# Altium schematic sheet LEDA_Arcade Controller Touch sensor.schdoc
size 306 x 217 mm
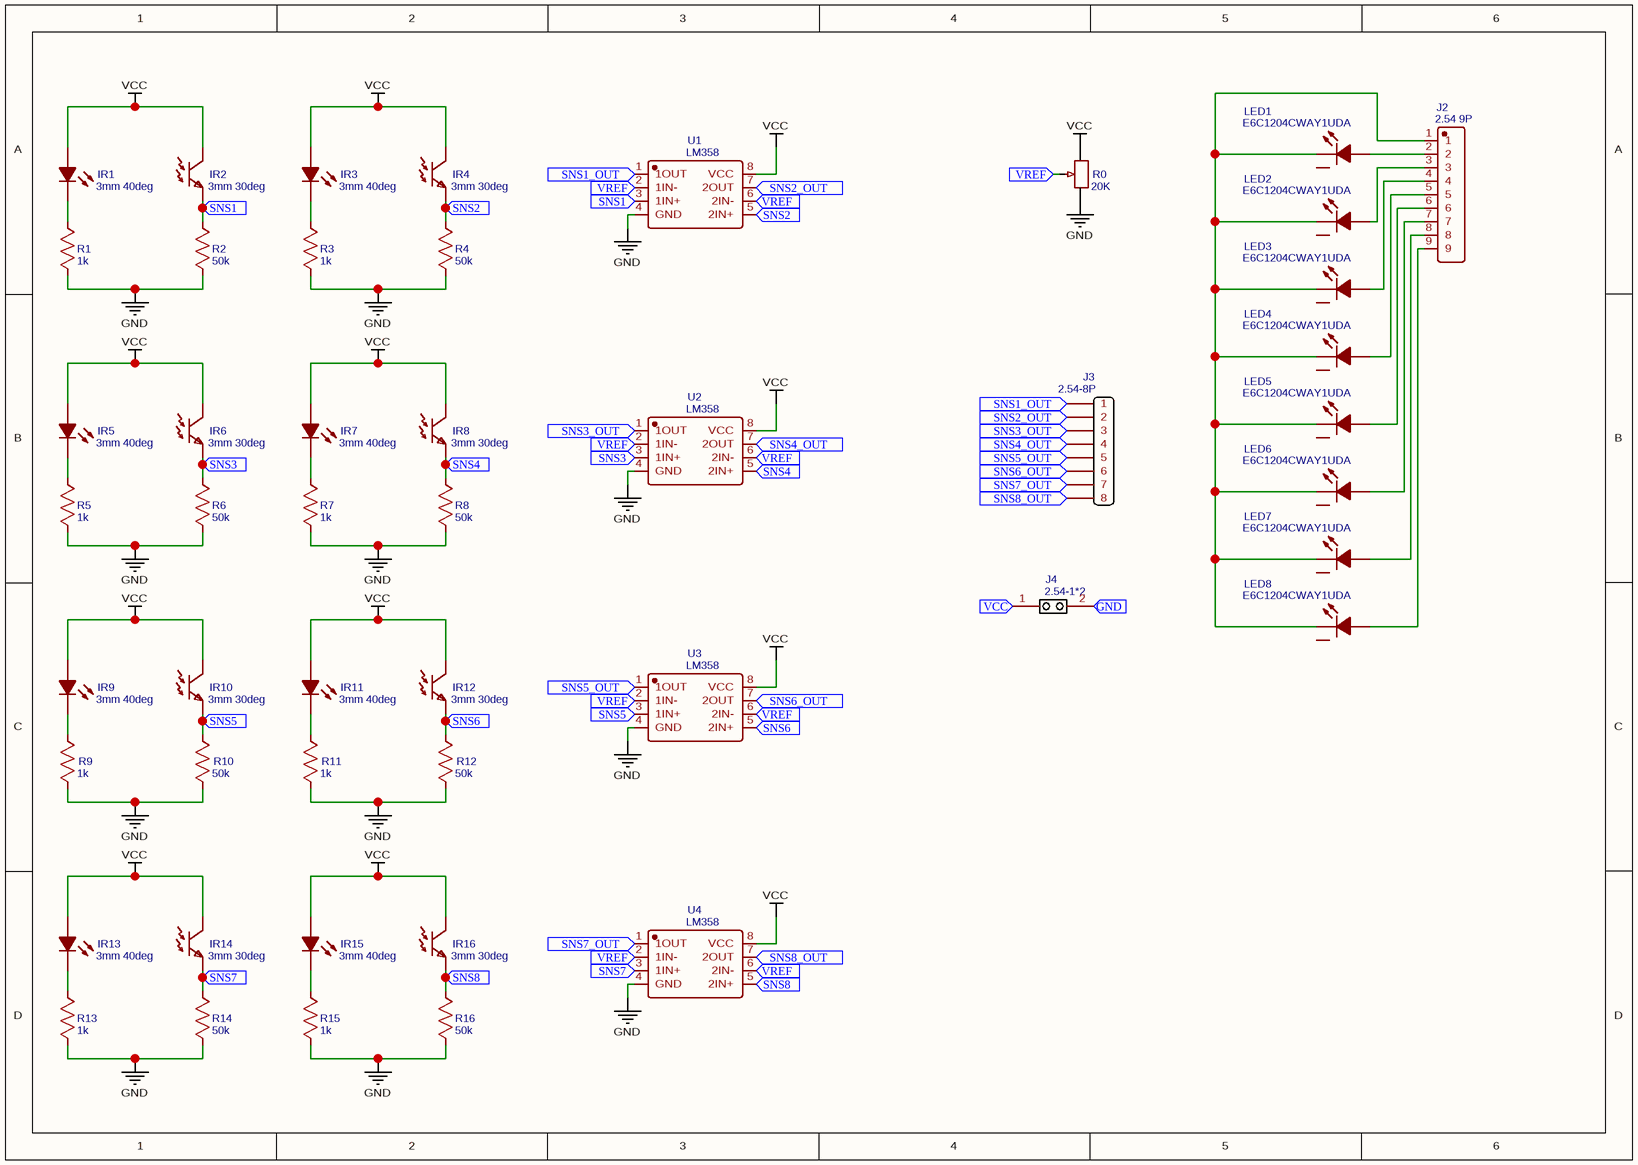
[diagram p0: LEDA_Arcade Controller Touch sensor.schdoc]

## Parts
IR1  3mm 40deg  [DIODE_IR204-A-L]
IR2  3mm 30deg  [IR-3MM/2.54]
IR3  3mm 40deg  [DIODE_IR204-A-L]
IR4  3mm 30deg  [IR-3MM/2.54]
IR5  3mm 40deg  [DIODE_IR204-A-L]
IR6  3mm 30deg  [IR-3MM/2.54]
IR7  3mm 40deg  [DIODE_IR204-A-L]
IR8  3mm 30deg  [IR-3MM/2.54]
IR9  3mm 40deg  [DIODE_IR204-A-L]
IR10  3mm 30deg  [IR-3MM/2.54]
IR11  3mm 40deg  [DIODE_IR204-A-L]
IR12  3mm 30deg  [IR-3MM/2.54]
IR13  3mm 40deg  [DIODE_IR204-A-L]
IR14  3mm 30deg  [IR-3MM/2.54]
IR15  3mm 40deg  [DIODE_IR204-A-L]
IR16  3mm 30deg  [IR-3MM/2.54]
J2  2.54 9P  [1X9_2.54MM_PTH]
J3  2.54-8P  [2.54-1*8P_TIGHT_JX]
J4  2.54-1*2  [2.54-1*2P_JX]
LED1  E6C1204CWAY1UDA  [LED-SMD_3P-L3.20-W1.50-R-RD]
LED2  E6C1204CWAY1UDA  [LED-SMD_3P-L3.20-W1.50-R-RD]
LED3  E6C1204CWAY1UDA  [LED-SMD_3P-L3.20-W1.50-R-RD]
LED4  E6C1204CWAY1UDA  [LED-SMD_3P-L3.20-W1.50-R-RD]
LED5  E6C1204CWAY1UDA  [LED-SMD_3P-L3.20-W1.50-R-RD]
LED6  E6C1204CWAY1UDA  [LED-SMD_3P-L3.20-W1.50-R-RD]
LED7  E6C1204CWAY1UDA  [LED-SMD_3P-L3.20-W1.50-R-RD]
LED8  E6C1204CWAY1UDA  [LED-SMD_3P-L3.20-W1.50-R-RD]
R0  20K  [RES-ADJ_3296X]
R1  1k  [0603]
R2  50k  [0603]
R3  1k  [0603]
R4  50k  [0603]
R5  1k  [0603]
R6  50k  [0603]
R7  1k  [0603]
R8  50k  [0603]
R9  1k  [0603]
R10  50k  [0603]
R11  1k  [0603]
R12  50k  [0603]
R13  1k  [0603]
R14  50k  [0603]
R15  1k  [0603]
R16  50k  [0603]
U1  LM358  [SOIC-8_8PIN-L5.00-W6.20-PITCH1.27-BL]
U2  LM358  [SOIC-8_8PIN-L5.00-W6.20-PITCH1.27-BL]
U3  LM358  [SOIC-8_8PIN-L5.00-W6.20-PITCH1.27-BL]
U4  LM358  [SOIC-8_8PIN-L5.00-W6.20-PITCH1.27-BL]

## Ports
GND, SNS1, SNS1_OUT, SNS2, SNS2_OUT, SNS3, SNS3_OUT, SNS4, SNS4_OUT, SNS5, SNS5_OUT, SNS6, SNS6_OUT, SNS7, SNS7_OUT, SNS8, SNS8_OUT, VCC, VREF

## Nets
GND: R0.3 R1.1 R2.1 R3.1 R4.1 R5.1 R6.1 R7.1 R8.1 R9.1 R10.1 R11.1 R12.1 R13.1 R14.1 R15.1 R16.1 U1.4(GND) U2.4(GND) U3.4(GND) U4.4(GND)
VCC: IR1.2(A) IR2.2(C) IR3.2(A) IR4.2(C) IR5.2(A) IR6.2(C) IR7.2(A) IR8.2(C) IR9.2(A) IR10.2(C) IR11.2(A) IR12.2(C) IR13.2(A) IR14.2(C) IR15.2(A) IR16.2(C) R0.1 U1.8(VCC) U2.8(VCC) U3.8(VCC) U4.8(VCC)
GND: J4.2 ; port GND  [a separate net that carries the same name]
SNS1: IR2.1(E) R2.2 U1.3(1IN+) ; port SNS1
SNS1_OUT: J3.1 U1.1(1OUT) ; port SNS1_OUT
SNS2: IR4.1(E) R4.2 U1.5(2IN+) ; port SNS2
SNS2_OUT: J3.2 U1.7(2OUT) ; port SNS2_OUT
SNS3: IR6.1(E) R6.2 U2.3(1IN+) ; port SNS3
SNS3_OUT: J3.3 U2.1(1OUT) ; port SNS3_OUT
SNS4: IR8.1(E) R8.2 U2.5(2IN+) ; port SNS4
SNS4_OUT: J3.4 U2.7(2OUT) ; port SNS4_OUT
SNS5: IR10.1(E) R10.2 U3.3(1IN+) ; port SNS5
SNS5_OUT: J3.5 U3.1(1OUT) ; port SNS5_OUT
SNS6: IR12.1(E) R12.2 U3.5(2IN+) ; port SNS6
SNS6_OUT: J3.6 U3.7(2OUT) ; port SNS6_OUT
SNS7: IR14.1(E) R14.2 U4.3(1IN+) ; port SNS7
SNS7_OUT: J3.7 U4.1(1OUT) ; port SNS7_OUT
SNS8: IR16.1(E) R16.2 U4.5(2IN+) ; port SNS8
SNS8_OUT: J3.8 U4.7(2OUT) ; port SNS8_OUT
VCC: J4.1 ; port VCC  [a separate net that carries the same name]
VREF: R0.2 U1.2(1IN-) U1.6(2IN-) U2.2(1IN-) U2.6(2IN-) U3.2(1IN-) U3.6(2IN-) U4.2(1IN-) U4.6(2IN-) ; port VREF
NetIR1_1: IR1.1(C) R1.2
NetIR3_1: IR3.1(C) R3.2
NetIR5_1: IR5.1(C) R5.2
NetIR7_1: IR7.1(C) R7.2
NetIR9_1: IR9.1(C) R9.2
NetIR11_1: IR11.1(C) R11.2
NetIR13_1: IR13.1(C) R13.2
NetIR15_1: IR15.1(C) R15.2
NetJ2_1: J2.1 LED1.2(-) LED2.2(-) LED3.2(-) LED4.2(-) LED5.2(-) LED6.2(-) LED7.2(-) LED8.2(-)
NetJ2_2: J2.2 LED1.1(+)
NetJ2_3: J2.3 LED2.1(+)
NetJ2_4: J2.4 LED3.1(+)
NetJ2_5: J2.5 LED4.1(+)
NetJ2_6: J2.6 LED5.1(+)
NetJ2_7: J2.7 LED6.1(+)
NetJ2_8: J2.8 LED7.1(+)
NetJ2_9: J2.9 LED8.1(+)

Not connected (* = marked no-connect by the designer): LED1 3; LED2 3; LED3 3; LED4 3; LED5 3; LED6 3; LED7 3; LED8 3

## Library data of the parts
IR1 IR3 IR5 IR7 IR9 IR11 IR13 IR15 = 3mm 40deg: BOM_Manufacturer: EVERLIGHT; BOM_Manufacturer Part: IR204C-A-L; BOM_Supplier: LCSC; BOM_Supplier Part: C98863; spicePre: U
IR2 IR4 IR6 IR8 IR10 IR12 IR14 IR16 = 3mm 30deg: BOM_Manufacturer: EVERLIGHT; BOM_Manufacturer Part: pt204-6c; BOM_Supplier: LCSC; image: //image.lceda.cn/szlcsc/C45857.jpg; BOM_Supplier Part: C45857; spicePre: I
J2 = 2.54 9P: Contributor: 6B732F50; spicePre: J
J3 = 2.54-8P: Contributor: shadow; BOM_Supplier Part: C115245; BOM_Supplier: LCSC; spicePre: P
J4 = 2.54-1*2: Contributor: Marshal; spicePre: P
LED1-LED8 = E6C1204CWAY1UDA: BOM_Manufacturer: EKINGLUX; Contributor: LCSC; BOM_Supplier: LCSC; BOM_Supplier Part: C375483; BOM_Manufacturer Part: E6C1204CWAY1UDA; spicePre: L
R0 = 20K: BOM_Manufacturer: BOURNS; BOM_Manufacturer Part: 3296X-1-203LF; nameAlias: Resistance(Ohms); BOM_Supplier: LCSC; BOM_Supplier Part: C111783; spicePre: R; spiceSymbolName: 3296X-1-203LF
R1 R3 R5 R7 R9 R11 R13 R15 = 1k: nameAlias: Value(Ω); spicePre: R; spiceSymbolName: Res_0603(1/10W)_US
R2 R4 R6 R8 R10 R12 R14 R16 = 50k: nameAlias: Value(Ω); spicePre: R; spiceSymbolName: Res_0603(1/10W)_US
U1-U4 = LM358: BOM_Manufacturer: IDCHIP; Contributor: LCSC; BOM_Supplier: LCSC; BOM_Supplier Part: C329455; BOM_Manufacturer Part: LM358; spicePre: U